# EAGLE design MicroMod-Ethernet-Function-Board (EAGLE 9.6.2)
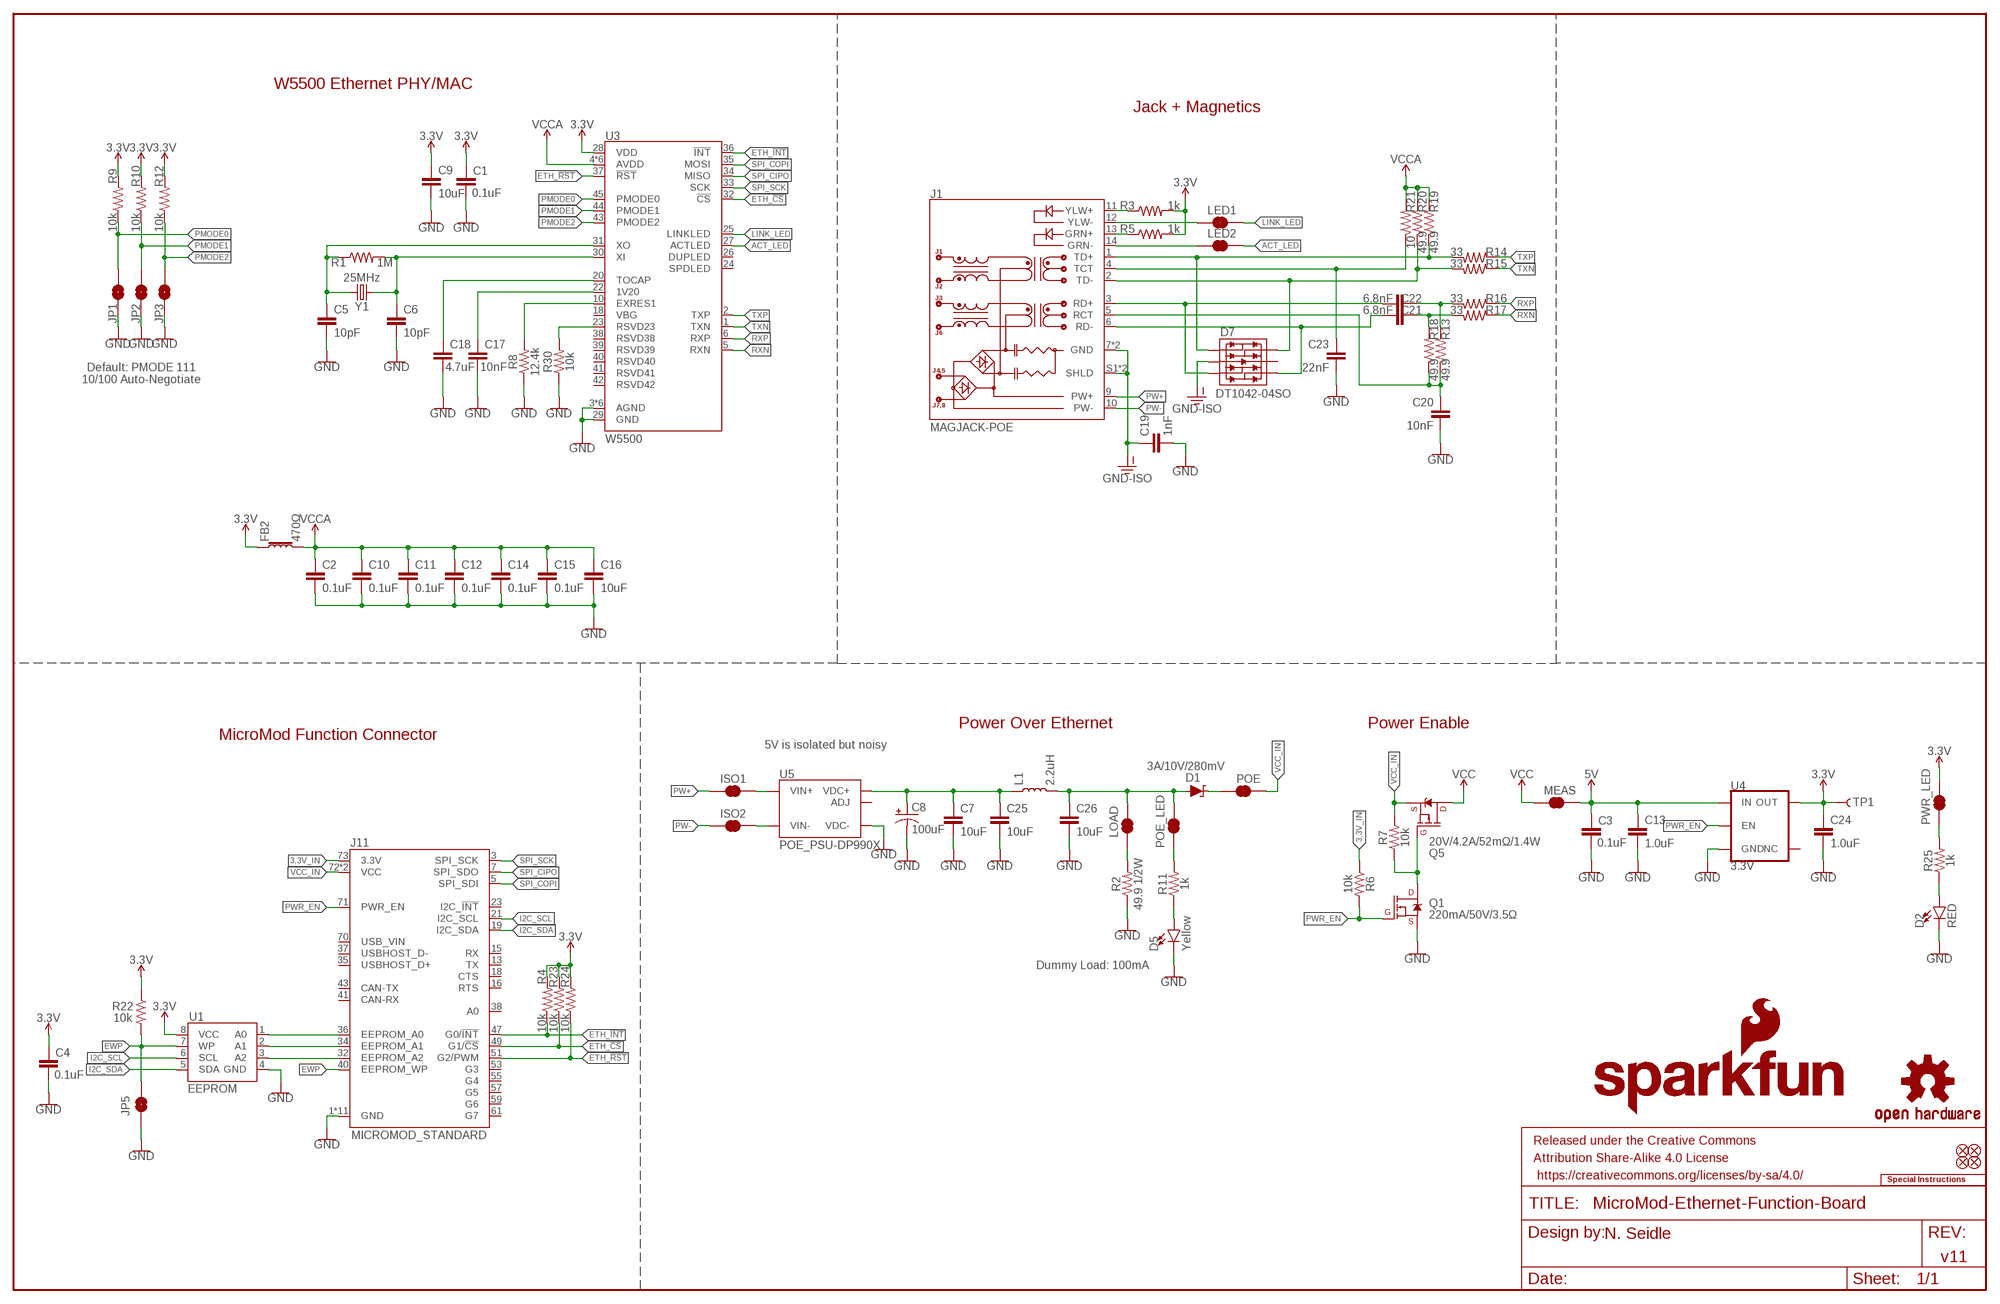
[diagram p0: schematic, sheet 1]

## Parts
C1  0.1uF  0.1UF-0603-25V-(+80/-20%)  [0603]
C2  0.1uF  0.1UF-0603-25V-5%  [0603]
C3  0.1uF  0.1UF-0603-25V-(+80/-20%)  [0603]
C4  0.1uF  0.1UF-0603-25V-(+80/-20%)  [0603]
C5  10pF  10PF-0603-50V-5%  [0603]
C6  10pF  10PF-0603-50V-5%  [0603]
C7  10uF  10UF-0805-25V-10%  [0805]
C8  100uF  100UF-POLAR-25V-20%(ELEC)  [PANASONIC_D]
C9  10uF  10UF-0603-6.3V-20%  [0603]
C10  0.1uF  0.1UF-0603-25V-5%  [0603]
C11  0.1uF  0.1UF-0603-25V-5%  [0603]
C12  0.1uF  0.1UF-0603-25V-5%  [0603]
C13  1.0uF  1.0UF-0603-16V-10%  [0603]
C14  0.1uF  0.1UF-0603-25V-5%  [0603]
C15  0.1uF  0.1UF-0603-25V-5%  [0603]
C16  10uF  10UF-0603-6.3V-20%  [0603]
C17  10nF  10NF-0603-50V-10%  [0603]
C18  4.7uF  4.7UF-0603-6.3V-(10%)  [0603]
C19  1nF  1.0NF/1000PF-1206-2KV-10%  [1206]
C20  10nF  10NF-0603-50V-10%  [0603]
C21  6.8nF  6.8NF/6800PF-0603-50V-5%  [0603]
C22  6.8nF  6.8NF/6800PF-0603-50V-5%  [0603]
C23  22nF  22NF/22,000PF-0603-50V-10%  [0603]
C24  1.0uF  1.0UF-0603-16V-10%-X7R  [0603]
C25  10uF  10UF-0805-25V-10%  [0805]
C26  10uF  10UF-0805-25V-10%  [0805]
D1  3A/10V/280mV  DIODE-SCHOTTKY-BAT60A  [SOD-323]
D2  RED  LED-RED0603  [LED-0603]
D5  Yellow  LED-YELLOW0603  [LED-0603]
D7  DT1042-04SO  TVS_DIODE_ARRAYSMD  [SOT-23-6]
FB2  470Ω  FERRITE_BEAD-0603-470Ω-100MHZ-1A-200MILIΩ  [0603]
FD1  FIDUCIALUFIDUCIAL  [FIDUCIAL-MICRO]
FD2  FIDUCIALUFIDUCIAL  [FIDUCIAL-MICRO]
FD3  FIDUCIALUFIDUCIAL  [FIDUCIAL-MICRO]
FD4  FIDUCIALUFIDUCIAL  [FIDUCIAL-MICRO]
FRAME1  FRAME-LEDGER  [CREATIVE_COMMONS]
ISO1  JUMPER-COMBO_2_NC_TRACE  [COMBO-JUMPER_2_NC_TRACE]
ISO2  JUMPER-COMBO_2_NC_TRACE  [COMBO-JUMPER_2_NC_TRACE]
J1  MAGJACK-POE  [MAGJACK-SYM_LED]
J11  MICROMOD_STANDARD  [M.2-CARD-E-22_FUNCTION_STANDARD]
JP1  JUMPER-SMT_2_NO_SILK  [SMT-JUMPER_2_NO_SILK]
JP2  JUMPER-SMT_2_NO_SILK  [SMT-JUMPER_2_NO_SILK]
JP3  JUMPER-SMT_2_NO_SILK  [SMT-JUMPER_2_NO_SILK]
JP5  JUMPER-SMT_2_NO_SILK  [SMT-JUMPER_2_NO_SILK]
L1  2.2uH  INDUCTOR-0805_WIDE-2.2UH  [0805-WIDE]
LED1  JUMPER-SMT_2_NC_TRACE_SILK  [SMT-JUMPER_2_NC_TRACE_SILK]
LED2  JUMPER-SMT_2_NC_TRACE_SILK  [SMT-JUMPER_2_NC_TRACE_SILK]
LOAD  JUMPER-SMT_2_NC_TRACE_SILK  [SMT-JUMPER_2_NC_TRACE_SILK]
LOGO1  SFE_LOGO_NAME_FLAME.1_INCH  [SFE_LOGO_NAME_FLAME_.1]
LOGO2  SPECIAL_INSTRUCTIONS-ORDERING  [ORDERING_INSTRUCTIONS]
LOGO3  OSHW-LOGOMINI  [OSHW-LOGO-MINI]
MEAS  JUMPER-COMBO_2_NC_TRACE  [COMBO-JUMPER_2_NC_TRACE]
POE  JUMPER-SMT_2_NC_TRACE_SILK  [SMT-JUMPER_2_NC_TRACE_SILK]
POE_LED  JUMPER-SMT_2_NC_TRACE_SILK  [SMT-JUMPER_2_NC_TRACE_SILK]
PWR_LED  JUMPER-SMT_2_NC_TRACE_SILK  [SMT-JUMPER_2_NC_TRACE_SILK]
Q1  220mA/50V/3.5Ω  MOSFET-NCH-BSS138  [SOT23-3]
Q5  20V/4.2A/52mΩ/1.4W  MOSFET_PCH-DMG2305UX-7  [SOT23-3]
R1  1M  1MOHM-0603-1/4W-5%  [0603]
R2  49.9 1/2W  49.9OHM-1206-1/2W-1%  [1206]
R3  1k  1KOHM-0603-1/10W-1%  [0603]
R4  10k  10KOHM-0603-1/10W-1%  [0603]
R5  1k  1KOHM-0603-1/10W-1%  [0603]
R6  10k  10KOHM-0603-1/10W-1%  [0603]
R7  10k  10KOHM-0603-1/10W-1%  [0603]
R8  12.4k  12.4KOHM-0603-1/10W-1%  [0603]
R9  10k  10KOHM-0603-1/10W-1%  [0603]
R10  10k  10KOHM-0603-1/10W-1%  [0603]
R11  1k  1KOHM-0603-1/10W-1%  [0603]
R12  10k  10KOHM-0603-1/10W-1%  [0603]
R13  49.9  49.9OHM-0603-1/10W-1%  [0603]
R14  33  33OHM-0603-1/10W-1%  [0603]
R15  33  33OHM-0603-1/10W-1%  [0603]
R16  33  33OHM-0603-1/10W-1%  [0603]
R17  33  33OHM-0603-1/10W-1%  [0603]
R18  49.9  49.9OHM-0603-1/10W-1%  [0603]
R19  49.9  49.9OHM-0603-1/10W-1%  [0603]
R20  49.9  49.9OHM-0603-1/10W-1%  [0603]
R21  10  10OHM-0603-1/10W-1%  [0603]
R22  10k  10KOHM-0603-1/10W-1%  [0603]
R23  10k  10KOHM-0603-1/10W-1%  [0603]
R24  10k  10KOHM-0603-1/10W-1%  [0603]
R25  1k  1KOHM-0603-1/10W-1%  [0603]
R30  10k  10KOHM-0603-1/10W-1%  [0603]
TP1  TEST-POINT3X4  [PAD.03X.04]
U1  EEPROM  EEPROM-I2C512K  [SO08]
U3  W5500  [LQFP-48]
U4  3.3V  V_REG_AP2112K-3.3V  [SOT23-5]
U5  POE_PSU-DP990X  [DP990X]
Y1  25MHz  CRYSTAL-25MHZ-SMD-2.0X1.6MM  [CRYSTAL-SMD-2.0X1.6MM]

## Nets
3.3V: C1.1 C4.1 C9.1 C24.1 FB2.1 PWR_LED.2 R3.2 R4.2 R5.2 R9.2 R10.2 R12.2 R22.1 R23.2 R24.2 TP1.1 U1.8(VCC) U3.28(VDD) U4.5(OUT)
3.3V_IN: J11.73(3.3V) R6.1
5V: C3.1 C13.1 MEAS.2 MEAS.4 U4.1(IN)
5V_FILTER: C26.1 D1.A L1.2 LOAD.2 POE_LED.2
5V_RAW: C7.1 C8.+ C25.1 L1.1 U5.1(VDC+) U5.2(VDC+)
A0: J11.36(EEPROM_A0) U1.1(A0)
A1: J11.34(EEPROM_A1) U1.2(A1)
A2: J11.32(EEPROM_A2) U1.3(A2)
ACT_LED: LED2.2 U3.27(ACTLED)
ETH_!CS!: J11.49(G1/!CS!) R23.1 U3.32(!CS!)
ETH_!INT!: J11.47(G0/!INT!) R4.1 U3.36(!INT!)
ETH_!RST!: J11.51(G2/PWM) R24.1 U3.37(!RST!)
EWP: J11.40(EEPROM_WP) JP5.2 R22.2 U1.7(WP)
GND: C1.2 C2.2 C3.2 C4.2 C5.2 C6.2 C7.2 C8.- C9.2 C10.2 C11.2 C12.2 C13.2 C14.2 C15.2 C16.2 C17.2 C18.2 C19.2 C20.2 C23.2 C24.2 C25.2 C26.2 D2.C D5.C J11.1(GND) J11.33(GND) J11.39(GND) J11.45(GND) J11.75(GND) J11.GND1(GND) J11.GND2(GND) J11.GND3(GND) J11.GND4(GND) J11.GND5(GND) J11.GND6(GND) JP1.1 JP2.1 JP3.1 JP5.1 Q1.2(S) R2.1 R8.1 R30.1 U1.4(GND) U3.3(AGND) U3.9(AGND) U3.14(AGND) U3.16(AGND) U3.19(AGND) U3.29(GND) U3.48(AGND) U4.2(GND) U5.3(VDC-)
GND-ISO: C19.1 D7.2(VSS) J1.7(GND) J1.8(GND) J1.S1(SHLD) J1.S2(SHLD)
I2C_SCL: J11.21(I2C_SCL) U1.6(SCL)
I2C_SDA: J11.19(I2C_SDA) U1.5(SDA)
LINK_LED: LED1.2 U3.25(LINKLED)
N$1: C5.1 R1.1 U3.31(XO) Y1.1
N$2: C6.1 R1.2 U3.30(XI) Y1.3
N$3: J1.14(GRN-) LED2.1
N$4: J1.12(YLW-) LED1.1
N$5: D5.A R11.1
N$6: POE_LED.1 R11.2
N$7: D1.C POE.1
N$8: J1.13(GRN+) R5.1
N$9: LOAD.1 R2.2
N$10: J1.11(YLW+) R3.1
N$11: Q1.3(D) Q5.1(G) R7.1
N$13: R8.2 U3.10(EXRES1)
N$15: C17.1 U3.22(1V20)
N$16: C18.1 U3.20(TOCAP)
N$17: R30.2 U3.23(RSVD23)
N$19: PWR_LED.1 R25.2
N$20: D2.A R25.1
PMODE0: JP1.2 R9.1 U3.45(PMODE0)
PMODE1: JP2.2 R10.1 U3.44(PMODE1)
PMODE2: JP3.2 R12.1 U3.43(PMODE2)
PW1+: ISO1.2 ISO1.4 U5.5(VIN+) U5.6(VIN+)
PW1-: ISO2.2 ISO2.4 U5.7(VIN-) U5.8(VIN-)
PW+: ISO1.1 ISO1.3 J1.9(PW+)
PW-: ISO2.1 ISO2.3 J1.10(PW-)
PWR_EN: J11.71(PWR_EN) Q1.1(G) R6.2 U4.3(EN)
RCT: C20.1 J1.5(RCT) R13.1 R18.1
RD+: C22.2 D7.3(IO2) J1.3(RD+)
RD-: C21.2 D7.4(IO3) J1.6(RD-)
RXN: R17.1 U3.5(RXN)
RXN1: C21.1 R17.2 R18.2
RXP: R16.1 U3.6(RXP)
RXP1: C22.1 R13.2 R16.2
SPI_CIPO: J11.7(SPI_SDO) U3.34(MISO)
SPI_COPI: J11.5(SPI_SDI) U3.35(MOSI)
SPI_SCK: J11.3(SPI_SCK) U3.33(SCK)
TCT: C23.1 J1.4(TCT) R21.1
TD+: D7.1(IO1) J1.1(TD+) R14.2 R19.1
TD-: D7.6(IO4) J1.2(TD-) R15.2 R20.1
TXN: R15.1 U3.1(TXN)
TXP: R14.1 U3.2(TXP)
VCC: MEAS.1 MEAS.3 Q5.3(D)
VCC_IN: J11.72(VCC) J11.74(VCC) POE.2 Q5.2(S) R7.2
VCCA: C2.1 C10.1 C11.1 C12.1 C14.1 C15.1 C16.1 FB2.2 R19.2 R20.2 R21.2 U3.4(AVDD) U3.8(AVDD) U3.11(AVDD) U3.15(AVDD) U3.17(AVDD) U3.21(AVDD)
Unconnected: D7.5(VCC) J11.13(TX) J11.15(RX) J11.16(RTS) J11.18(CTS) J11.23(I2C_!INT!) J11.35(USBHOST_D+) J11.37(USBHOST_D-) J11.38(A0) J11.41(CAN-RX) J11.43(CAN-TX) J11.53(G3) J11.55(G4) J11.57(G5) J11.59(G6) J11.61(G7) J11.70(USB_VIN) U3.18(VBG) U3.24(SPDLED) U3.26(DUPLED) U3.38(RSVD38) U3.39(RSVD39) U3.40(RSVD40) U3.41(RSVD41) U3.42(RSVD42) U4.4(NC) U5.4(ADJ)

## Notes on the sheet
- W5500 Ethernet PHY/MAC
- Jack + Magnetics
- Default: PMODE 111
  10/100 Auto-Negotiate
- Power Over Ethernet | Power Enable
- MicroMod Function Connector
- 5V is isolated but noisy
- Dummy Load: 100mA
- N. Seidle
- v11

## Library data of the parts
C1 C3 C4 = SparkFun-Capacitors:0.1UF: 0.1µF ceramic capacitors A capacitor is a passive two-terminal electrical component used to store electrical energy temporarily in an electric field.; PROD_ID: CAP-00810
C2 C10-C12 C14 C15 = SparkFun-Capacitors:0.1UF: 0.1µF ceramic capacitors A capacitor is a passive two-terminal electrical component used to store electrical energy temporarily in an electric field.; PROD_ID: CAP-08604
C5 C6 = SparkFun-Capacitors:10PF: 10pF ceramic capacitors A capacitor is a passive two-terminal electrical component used to store electrical energy temporarily in an electric field.; PROD_ID: CAP-11812
C7 C25 C26 = SparkFun-Capacitors:10UF: 10.0µF ceramic capacitors A capacitor is a passive two-terminal electrical component used to store electrical energy temporarily in an electric field.; PROD_ID: CAP-14259
C8 = SparkFun-Capacitors:100UF-POLAR: 100µF polarized capacitors A capacitor is a passive two-terminal electrical component used to store electrical energy temporarily in an electric field.; PROD_ID: CAP-12547
C9 C16 = SparkFun-Capacitors:10UF: 10.0µF ceramic capacitors A capacitor is a passive two-terminal electrical component used to store electrical energy temporarily in an electric field.; PROD_ID: CAP-11015
C13 = SparkFun-Capacitors:1.0UF: 1µF ceramic capacitors A capacitor is a passive two-terminal electrical component used to store electrical energy temporarily in an electric field.; PROD_ID: CAP-00868
C17 C20 = SparkFun-Capacitors:10NF: 0.01uF/10nF/10,000pF ceramic capacitors A capacitor is a passive two-terminal electrical component used to store electrical energy temporarily in an electric field. CAP-09321; PROD_ID: CAP-00867
C18 = SparkFun-Capacitors:4.7UF: 4.7µF ceramic capacitors A capacitor is a passive two-terminal electrical component used to store electrical energy temporarily in an electric field.; PROD_ID: CAP-08280
C19 = SparkFun-Capacitors:1.0NF/1000PF: 1nF/1,000pF ceramic capacitors A capacitor is a passive two-terminal electrical component used to store electrical energy temporarily in an electric field.; PROD_ID: CAP-16238
C21 C22 = SparkFun-Capacitors:6.8NF/6800PF: 5.6nF/5600pF ceramic capacitors A capacitor is a passive two-terminal electrical component used to store electrical energy temporarily in an electric field.; PROD_ID: CAP-16239
C23 = SparkFun-Capacitors:22NF/22,000PF: 0.022uF/22nF/22,000pF ceramic capacitors A capacitor is a passive two-terminal electrical component used to store electrical energy temporarily in an electric field.; PROD_ID: CAP-07885
C24 = SparkFun-Capacitors:1.0UF: 1µF ceramic capacitors A capacitor is a passive two-terminal electrical component used to store electrical energy temporarily in an electric field.; PROD_ID: CAP-13930
D1 = SparkFun-DiscreteSemi:DIODE-SCHOTTKY: Schottky diode A Schottky diode is a semiconductor diode which has a low forward voltage drop and a very fast switching action.; PROD_ID: DIO-14072
D2 = SparkFun-LED:LED-RED: Red SMD LED Used in manufacturing of most products at SparkFun Packages: 0603 - SMD 0603 package [Product Link] <http://docs.avagotech.com/docs/AV02-0551EN> 0603 SMART - SMD 0603 SMART package ( more efficient and expensive)[Product Link] <http://www.osram-os.com/Graphics/XPic2/00077099_0.pdf> 1206 - SMD1206 package [Product Link] <https://www.sparkfun.com/datasheets/DevTools/LilyPad/Q150OVS4.pdff> SparkFun Products: Pro Mini 328 -5V <https://www.sparkfun.com/products/821> RedBoard <https://www.sparkfun.com/products/12757> IOIO-OTG <https://www.sparkfun.com/products/13613>; PROD_ID: DIO-00819
D5 = SparkFun-LED:LED-YELLOW: Yellow SMD LED Used in manufacturing several products at SparkFun. Packages: 0603 - SMD 0603 package[Product Link] <http://www.kingbrightusa.com/product.asp?catalog_name=LED&product_id=APT1608SYCK> 0603 -SMART - SMART SMD 0603 package (more efficient/more expensive) [Product Link] <http://www.osram-os.com/osram_os/en/products/product-catalog/led-light-emitting-diodes/smartled-0603/ly-l29k/index.jsp> LilyPad - SMD1206 package[Product Datasheet] <https://www.sparkfun.com/datasheets/DevTools/LilyPad/Q150YUS4.pdf> SparkFun Products: Blynk Board <https://www.sparkfun.com/products/13794> IOIO-OTG <https://www.sparkfun.com/products/13613> XBee Explorer Serial <https://www.sparkfun.com/products/13225>; PROD_ID: DIO-09003
D7 = SparkFun-DiscreteSemi:TVS_DIODE_ARRAY; PROD_ID: IC-13538; VALUE: ESD Diode
FB2 = SparkFun-Coils:FERRITE_BEAD: Ferrite Bead (blocks, cores, rings, chokes, etc.) Inductor with layers of ferrite used to suppress high frequencies. Often used to isolate high frequency noise. SparkFun Products: IOIO-OTG - V2.2 <https://www.sparkfun.com/products/13613> SparkFun SAMD21 Mini Breakout <https://www.sparkfun.com/products/13664> SparkFun 6 Degrees of Freedom Breakout - LSM6DS3 <https://www.sparkfun.com/products/13339> SparkFun SAMD21 Dev Breakout <https://www.sparkfun.com/products/13672>; PROD_ID: NDUC-12579
FD1-FD4 = SparkFun-Aesthetics:FIDUCIAL: Fiducial Alignment Points Point-of-reference for pick-and-place machines and other optical instruments.
FRAME1 = SparkFun-Aesthetics:FRAME-LEDGER: Schematic Frame - Ledger Standard 11x14 US Ledger frame
ISO1 ISO2 MEAS = SparkFun-Jumpers:JUMPER-COMBO_2_NC_TRACE
J1 = SparkFun-Connectors:MAGJACK-POE: MAGJACK: RJ-45 with POE and LEDs This is a single port, RJ45 ethernet jacks with built in transformer (magnetics), PoE rectifier diodes, status LEDs, and shielding.; PROD_ID: CONN-16253
J11 = SparkFun-MicroMod-Function:MICROMOD: MicroMod Connector Description: A card edge connector and mating PCB connector to allow various MicroMod Processor Boards to be coupled with various carrier boards of different capabilities. Based on the M.2 standard.
JP1-JP3 JP5 = SparkFun-Jumpers:JUMPER-SMT_2_NO: Normally open jumper This jumper has two pads in close proximity to each other. Apply solder to close the connection. Round pads are easier to solder for beginners, but are a lot larger. SparkFun Product that uses the round pads: SparkFun EL Sequencer <https://www.sparkfun.com/products/12781>
L1 = SparkFun-Coils:INDUCTOR: Inductors Resist changes in electrical current. Basically a coil of wire. SparkFun Products: SparkFun Load Cell Amplifier - HX711 <https://www.sparkfun.com/products/13879> IOIO-OTG - V2.2 <https://www.sparkfun.com/products/13613>; PROD_ID: NDUC-14234
LED1 LED2 LOAD POE POE_LED PWR_LED = SparkFun-Jumpers:JUMPER-SMT_2_NC_TRACE: Normally closed trace jumper This jumper has a trace between two pads so it's normally closed (NC). Use a razor knife to open the connection. For best results follow the IPC guidelines for cutting traces: Cutout at least 0.063 mm (0.005 in). Remove all loose material to clean up the cut area. Seal the cut with an approved epoxy. Reapply solder to reclose the connection.
LOGO1 = SparkFun-Aesthetics:SFE_LOGO_NAME_FLAME: SparkFun Font Logo w/ Flame This is the SparkFun full logo. The logo on the schematic will always be the same size; the package variant is the height of the flame part of the logo. Default layer for the logo on the board is tSilk.
LOGO2 = SparkFun-Aesthetics:SPECIAL_INSTRUCTIONS: Special Ordering/Production Instructions Alert Symbol for special PCB ordering instructions or unique production process warnings. Ordering Instructions Production Instructions Types of information that should be added to box: Copper weight Soldermask color Silk color PCB thickness Number of layers PCB Standard: 1.6mm FR4 1 oz copper immersion silver plating red soldermask white silkscreen Types of information that should be added to box: Special wash requirements Depaneling instructions Humidification Glue curing Default text settings: 0.07 inch 9% ratio 50% line distance
LOGO3 = SparkFun-Aesthetics:OSHW-LOGO: Open-Source Hardware (OSHW) Logo This logo indicates the piece of hardware it is found on incorporates a OSHW license and/or adheres to the definition of open source hardware found here: http://freedomdefined.org/OSHW
Q1 = SparkFun-DiscreteSemi:MOSFET-NCH: N-channel MOSFETs Voltage controlled devices that allow control of high current outputs. SparkFun Products: SparkFun OpenScale <https://www.sparkfun.com/products/13261> SparkFun Digital Sandbox <https://www.sparkfun.com/products/12651> SparkFun Monster Moto Shield <https://www.sparkfun.com/products/10182> SparkFun MOSFET Power Controller <https://www.sparkfun.com/products/11214>; PROD_ID: TRANS-00830
Q5 = SparkFun-DiscreteSemi:MOSFET_PCH: P-channel MOSFETs Voltage controlled devices that allow control of high current outputs. SparkFun Products: SparkFun ESP32 Thing <https://www.sparkfun.com/products/13907> SparkFun ESP8266 Thing <https://www.sparkfun.com/products/13231> SparkFun Pi Servo HAT V2 <https://www.sparkfun.com/products/15316> DMG2305UX-7 (20V/4.2A/SOT23-3); PROD_ID: TRANS-14388
R1 = SparkFun-Resistors:1MOHM: 1MΩ resistor A resistor is a passive two-terminal electrical component that implements electrical resistance as a circuit element. Resistors act to reduce current flow, and, at the same time, act to lower voltage levels within circuits. - Wikipedia; PROD_ID: RES-07868
R2 = SparkFun-Resistors:49.9OHM: 49.9Ω resistor A resistor is a passive two-terminal electrical component that implements electrical resistance as a circuit element. Resistors act to reduce current flow, and, at the same time, act to lower voltage levels within circuits. - Wikipedia; PROD_ID: RES-16252
R3 R5 R11 R25 = SparkFun-Resistors:1KOHM: 1kΩ resistor A resistor is a passive two-terminal electrical component that implements electrical resistance as a circuit element. Resistors act to reduce current flow, and, at the same time, act to lower voltage levels within circuits. - Wikipedia; PROD_ID: RES-07856
R4 R6 R7 R9 R10 R12 R22-R24 R30 = SparkFun-Resistors:10KOHM: 10kΩ resistor A resistor is a passive two-terminal electrical component that implements electrical resistance as a circuit element. Resistors act to reduce current flow, and, at the same time, act to lower voltage levels within circuits. - Wikipedia; PROD_ID: RES-00824
R8 = SparkFun-Resistors:12.4KOHM: 12.4kΩ resistor A resistor is a passive two-terminal electrical component that implements electrical resistance as a circuit element. Resistors act to reduce current flow, and, at the same time, act to lower voltage levels within circuits. - Wikipedia; PROD_ID: RES-16236
R13 R18-R20 = SparkFun-Resistors:49.9OHM: 49.9Ω resistor A resistor is a passive two-terminal electrical component that implements electrical resistance as a circuit element. Resistors act to reduce current flow, and, at the same time, act to lower voltage levels within circuits. - Wikipedia; PROD_ID: RES-16237
R14-R17 = SparkFun-Resistors:33OHM: 33Ω resistor A resistor is a passive two-terminal electrical component that implements electrical resistance as a circuit element. Resistors act to reduce current flow, and, at the same time, act to lower voltage levels within circuits. - Wikipedia; PROD_ID: RES-08270
R21 = SparkFun-Resistors:10OHM: 10Ω resistor A resistor is a passive two-terminal electrical component that implements electrical resistance as a circuit element. Resistors act to reduce current flow, and, at the same time, act to lower voltage levels within circuits. - Wikipedia; PROD_ID: RES-12581
TP1 = SparkFun-Connectors:TEST-POINT: SparkFun Test Points Bare copper test points for troubleshooting or In-Circuit-Testing. These are used by our Production team for verifying production board runs using pogo-pins on test beds. SparkFun Products: SparkFun LSM9DS1 Breakout <https://www.sparkfun.com/products/13284> SparkFun PSOC <https://www.sparkfun.com/products/13714> SparkFun Load Cell Amplifier <https://www.sparkfun.com/products/13879>
U1 = SparkFun-IC-Memory:EEPROM-I2C: I2C EEPROMs, 24LC256 and others 24LC256 Series 256 kb I2C 2 Wire (32 k x 8 Bit) 2.5 V Serial EEPROM SMD - SOIC-8 Datasheet SparkFun Products SparkFun UDB5 - PIC UAV Development Board <https://www.sparkfun.com/products/11703> (GPS-11703); PROD_ID: IC-14645
U3 = SparkFun-IC-Comms:W5500; PROD_ID: IC-16240
U4 = SparkFun-IC-Power:V_REG_AP2112: AP2112 - 600mA CMOS LDO Regulator w/ Enable The AP2112 is CMOS process low dropout linear regulator with enable function, the regulator delivers a guaranteed 600mA (min.) continuous load current. Features Output Voltage Accuracy: ±1.5% Output Current: 600mA (Min.) Foldback Short Current Protection: 50mA Enable Function to Turn ON/OFF VOUT Low Dropout Voltage (3.3V): 250mV (Typ.) @IOUT=600mA Excellent Load Regulation: 0.2%/A (Typ.) Excellent Line Regulation: 0.02%/V (Typ.) Low Quiescent Current: 55μA (Typ.) Low Standby Current: 0.01μA (Typ.) Low Output Noise: 50μVRMS PSRR: 100Hz -65dB, 1kHz -65dB OTSD Protection Stable with 1.0μF Flexible Cap: Ceramic, Tantalum and Aluminum Electrolytic Operation Temperature Range: -40°C to 85°C ESD: MM 400V, HBM 4000V; PROD_ID: VREG-12457
U5 = SparkFun-IC-Power:POE_PSU: A special function Power Over Ethernet module with 5V or 12V output. Comes in an SMD package.; PROD_ID: IC-16251
Y1 = SparkFun-Clocks:CRYSTAL-25MHZ: 25MHz Crystal; PROD_ID: XTAL-16235

## Net classes
0 default: width 0 mm, drill 0 mm
1 vcc: width 0 mm

## Board
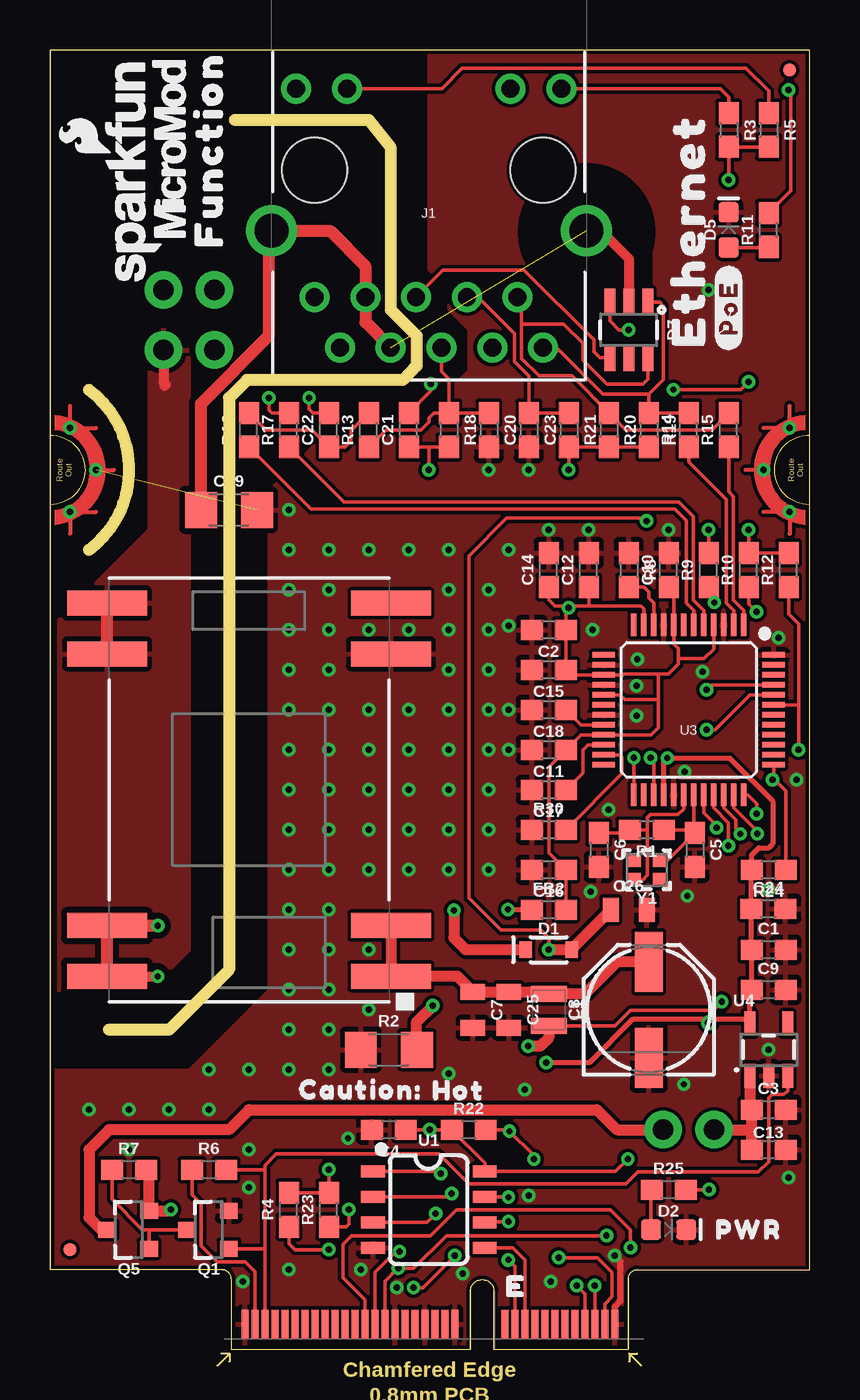
[diagram p1: board, top side]
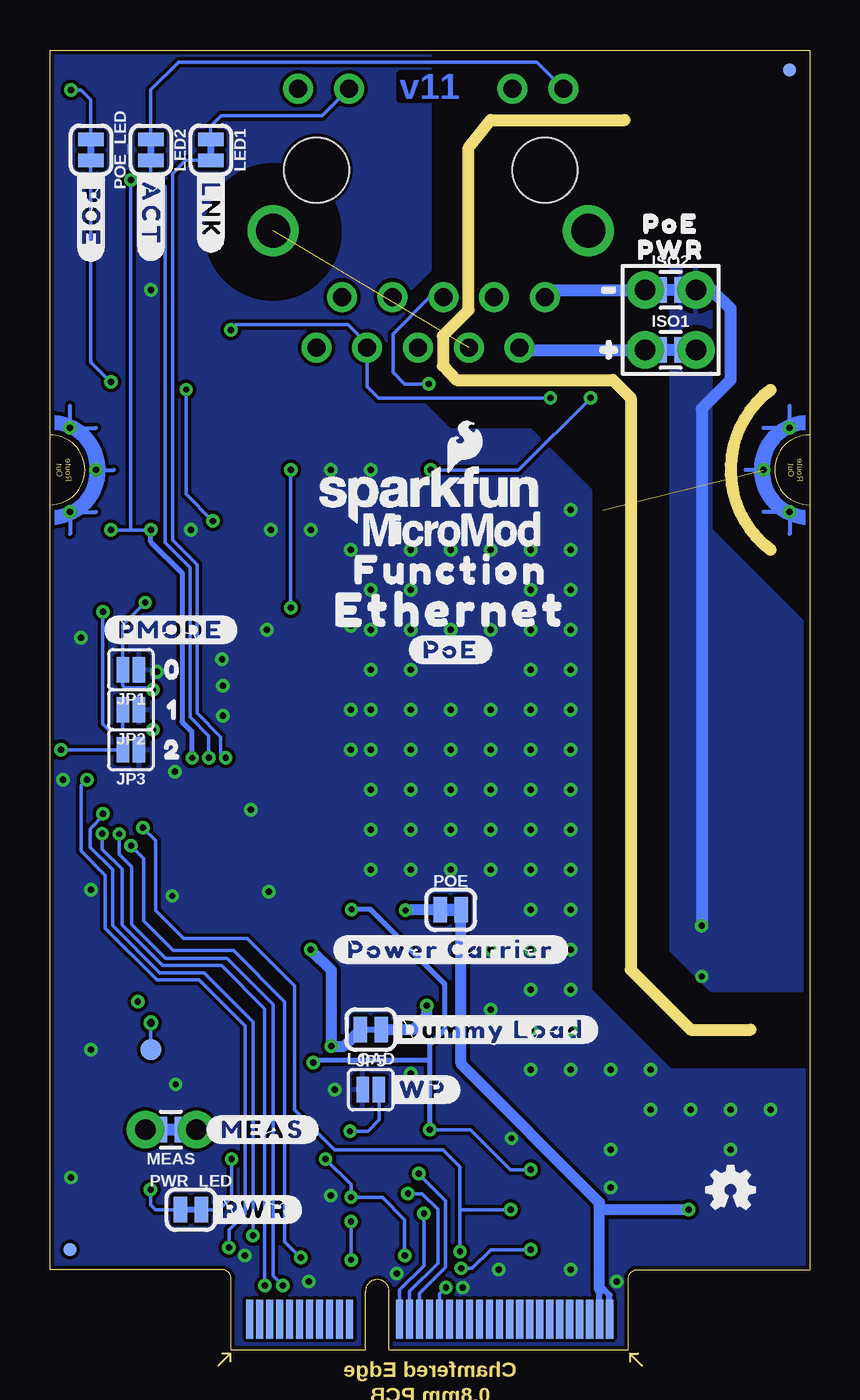
[diagram p2: board, bottom side, seen from below]

Size 38 x 65 mm. Coordinates in mm from the lower left corner, seen from the top.
Outline: 28.93,0 22.22,0 22.22,2.9 arc180 21.02,2.9 21.02,0 9.07,0 9.07,3.5 arc90 8.6,4 0,4 0,65 38,65 38,4 29.4,4 arc90 28.93,3.5 28.93,0
Copper layers (1*16): Top/Horz 0.035mm / dielectric 1.5mm / Bottom/Vert 0.035mm
Design rules "SparkFun-2-layer-TIGHT *": minimum track width 7mil, minimum drill 12mil, track to track 7mil, track to pad 7mil, pad to pad 7mil, via to via 7mil, smd to smd 7mil, copper to edge 7mil, drill to drill 7mil, minimum pad ring 7mil, minimum via ring 7mil, stop-mask expansion 4mil, vias tented up to drill 25mil, thermal gap 10mil
tRestrict: area 23.7,52.8 to 30,59; area 26.7,52.3 to 29.9,55.9
bRestrict: area 23.7,52.8 to 30,59
Milling: 12 lines

### Footprints (pad centres in the part's own frame; a part is rotated, then mirrored left to right if it is on the bottom)
0603 = smd 1.1 x 1: 1 -0.85,0; 2 0.85,0
0805 = smd 0.8 x 1.2: 1 -0.9,0; 2 0.9,0
PANASONIC_D = smd 3 x 1.4: + 2.4,0; - -2.4,0
1206 = smd 1.6 x 1.8: 1 -1.4,0; 2 1.4,0
SOD-323 = smd 0.63 x 0.83: A 1.15,0; C -1.15,0
LED-0603 = smd 1 x 1: A -0.877,0; C 0.877,0
SOT-23-6 = smd 0.55 x 1.35: 1 -0.95,-1.375; 2 0,-1.375; 3 0.95,-1.375; 4 0.95,1.375; 5 0,1.375; 6 -0.95,1.375
FIDUCIAL-MICRO = smd 0.635 x 0.635: 1 0,0
COMBO-JUMPER_2_NC_TRACE = smd 0.635 x 1.27: 1 -0.508,0; 2 0.508,0 | drill 1.016 pad 1.88: 3 -1.27,0; 4 1.27,0
MAGJACK-SYM_LED = drill 0.9 pad 1.5: 1 -5.715,8.89; 2 -4.445,6.35; 3 -3.175,8.89; 4 -1.905,6.35; 5 -0.635,8.89; 6 0.635,6.35; 7 1.905,8.89; 8 3.175,6.35; 9 4.445,8.89; 10 5.715,6.35; 11 -6.63,-4.06; 12 -4.09,-4.06; 13 4.09,-4.06; 14 6.63,-4.06 | drill 1.7 pad 2.4: S1 -7.875,3.05; S2 7.875,3.05 | hole 3.25: -5.715,0; 5.715,0
M.2-CARD-E-22_FUNCTION_STANDARD = smd 0.35 x 1.45: 1 9.25,1.275; 3 8.75,1.275; 5 8.25,1.275; 7 7.75,1.275; 9 7.25,1.275; 11 6.75,1.275; 13 6.25,1.275; 15 5.75,1.275; 17 5.25,1.275; 19 4.75,1.275; 21 4.25,1.275; 23 3.75,1.275; 33 1.25,1.275; 35 0.75,1.275; 37 0.25,1.275; 39 -0.25,1.275; 41 -0.75,1.275; 43 -1.25,1.275; 45 -1.75,1.275; 47 -2.25,1.275; 49 -2.75,1.275; 51 -3.25,1.275; 53 -3.75,1.275; 55 -4.25,1.275; 57 -4.75,1.275; 59 -5.25,1.275; 61 -5.75,1.275; 63 -6.25,1.275; 65 -6.75,1.275; 67 -7.25,1.275; 69 -7.75,1.275; 71 -8.25,1.275; 73 -8.75,1.275; 75 -9.25,1.275 | smd 0.35 x 1.95 bottom: 2 9,1.525; 4 8.5,1.525; 6 8,1.525; 8 7.5,1.525; 10 7,1.525; 12 6.5,1.525; 14 6,1.525; 16 5.5,1.525; 18 5,1.525; 20 4.5,1.525; 22 4,1.525; 32 1.5,1.525; 34 1,1.525; 36 0.5,1.525; 38 0,1.525; 40 -0.5,1.525; 42 -1,1.525; 44 -1.5,1.525; 46 -2,1.525; 48 -2.5,1.525; 50 -3,1.525; 52 -3.5,1.525; 54 -4,1.525; 56 -4.5,1.525; 58 -5,1.525; 60 -5.5,1.525; 62 -6,1.525; 64 -6.5,1.525; 66 -7,1.525; 68 -7.5,1.525; 70 -8,1.525; 72 -8.5,1.525; 74 -9,1.525 | drill 0.305 pad 0.61: GND1 -18,41.9; GND2 -16.7,44; GND3 -18,46.1; GND4 18,41.9; GND5 16.7,44; GND6 18,46.1
SMT-JUMPER_2_NO_SILK = smd 0.635 x 1.27: 1 -0.406,0; 2 0.406,0
0805-WIDE = smd 0.8 x 1.8: 1 -0.8,0; 2 0.8,0
SMT-JUMPER_2_NC_TRACE_SILK = smd 0.66 x 1.27: 1 -0.521,0; 2 0.521,0
SOT23-3 = smd 0.8 x 0.9: 1 -0.95,-1; 2 0.95,-1; 3 0,1.1
PAD.03X.04 = smd 1.016 x 1.016: 1 0,0
SO08 = smd 0.6 x 1.2: 1 -1.905,-2.8; 2 -0.635,-2.8; 3 0.635,-2.8; 4 1.905,-2.8; 5 1.905,2.8; 6 0.635,2.8; 7 -0.635,2.8; 8 -1.905,2.8
LQFP-48 = smd 0.254 x 1.143: 1 -2.75,-4.25; 2 -2.25,-4.25; 3 -1.75,-4.25; 4 -1.25,-4.25; 5 -0.75,-4.25; 6 -0.25,-4.25; 7 0.25,-4.25; 8 0.75,-4.25; 9 1.25,-4.25; 10 1.75,-4.25; 11 2.25,-4.25; 12 2.75,-4.25; 25 2.75,4.25; 26 2.25,4.25; 27 1.75,4.25; 28 1.25,4.25; 29 0.75,4.25; 30 0.25,4.25; 31 -0.25,4.25; 32 -0.75,4.25; 33 -1.25,4.25; 34 -1.75,4.25; 35 -2.25,4.25; 36 -2.75,4.25 | smd 1.143 x 0.254: 13 4.25,-2.75; 14 4.25,-2.25; 15 4.25,-1.75; 16 4.25,-1.25; 17 4.25,-0.75; 18 4.25,-0.25; 19 4.25,0.25; 20 4.25,0.75; 21 4.25,1.25; 22 4.25,1.75; 23 4.25,2.25; 24 4.25,2.75; 37 -4.25,2.75; 38 -4.25,2.25; 39 -4.25,1.75; 40 -4.25,1.25; 41 -4.25,0.75; 42 -4.25,0.25; 43 -4.25,-0.25; 44 -4.25,-0.75; 45 -4.25,-1.25; 46 -4.25,-1.75; 47 -4.25,-2.25; 48 -4.25,-2.75
SOT23-5 = smd 0.55 x 1.2: 1 -0.95,-1.3; 2 0,-1.3; 3 0.95,-1.3; 4 0.95,1.3; 5 -0.95,1.3
DP990X = smd 1.25 x 4: 1 -9.33,-7.1; 2 -6.79,-7.1; 3 6.79,-7.1; 4 9.33,-7.1; 5 9.33,7.1; 6 6.79,7.1; 7 -6.79,7.1; 8 -9.33,7.1
CRYSTAL-SMD-2.0X1.6MM = smd 0.75 x 0.7: 1 -0.675,-0.5; 2 0.675,-0.5; 3 0.675,0.5; 4 -0.675,0.5

### Placement (x,y rotation side)
C1  35.95,20 0 top
C2  24.95,36 180 top
C3  35.95,12 0 top
C4  16.95,11 180 top
C5  32.25,25 270 top
C6  27.45,25 270 top
C7  21.15,17 270 top
C8  29.95,17 90 top
C9  35.95,18 0 top
C10  30.95,39 90 top
C11  24.95,30 180 top
C12  26.95,39 90 top
C13  35.95,10 0 top
C14  24.95,39 90 top
C15  24.95,34 180 top
C16  24.95,24 180 top
C17  24.95,28 180 top
C18  24.95,32 180 top
C19  8.95,42 0 top
C20  21.95,46 270 top
C21  17.95,46 90 top
C22  13.95,46 90 top
C23  23.95,46 270 top
C24  35.94,22.05 0 top
C25  22.95,17 270 top
C26  28.95,22 0 top
D1  24.95,20 0 top
D2  30.95,6 0 top
D5  33.95,56 90 top
D7  28.95,51 180 top
FB2  24.95,22 0 top
FD1  1,5 90 top
FD2  37,64 90 top
FD3  37,5 270 bottom
FD4  1,64 270 bottom
FRAME1  35.51,-8.89 0 top  (outside the outline)
ISO1  6.95,50 0 bottom
ISO2  6.95,53 0 bottom
J1  18.95,59 180 top
J11  19,0 0 top
JP1  33.95,34 180 bottom
JP2  33.95,32 180 bottom
JP3  33.95,30 180 bottom
JP5  21.95,13 0 bottom
L1  24.95,17 270 top
LED1  29.95,60 270 bottom
LED2  32.95,60 270 bottom
LOAD  21.95,16 180 bottom
LOGO1  4.14,58.97 90 top
LOGO2  45.67,60.96 0 top  (outside the outline)
LOGO3  3.95,8 0 bottom
LOGO4  SFE_LOGO_NAME_FLAME.1_INCH  [SFE_LOGO_NAME_FLAME_.1]  18.97,42.76 0 bottom
MEAS  31.95,11 180 bottom
POE  17.95,22 0 bottom
POE_LED  35.95,60 270 bottom
PWR_LED  30.95,7 0 bottom
Q1  7.95,6 90 top
Q5  3.95,6 90 top
R1  29.85,26 180 top
R2  16.95,15 0 top
R3  33.95,61 270 top
R4  11.95,7 90 top
R5  35.95,61 270 top
R6  7.95,9 0 top
R7  3.95,9 0 top
R8  28.95,39 270 top
R9  32.95,39 90 top
R10  34.95,39 90 top
R11  35.95,56 90 top
R12  36.95,39 90 top
R13  15.95,46 90 top
R14  31.95,46 90 top
R15  33.95,46 90 top
R16  9.95,46 90 top
R17  11.95,46 90 top
R18  19.95,46 270 top
R19  29.95,46 270 top
R20  27.95,46 270 top
R21  25.95,46 270 top
R22  20.95,11 0 top
R23  13.95,7 90 top
R24  35.95,24 180 top
R25  30.95,8 0 top
R30  24.95,26 0 top
TP1  32.95,15 0 bottom
U1  18.95,7 270 top
U3  31.95,32 180 top
U4  35.95,15 0 top
U5  9.95,28 90 top
U$1  [ETHERNET0]  17.95,37 0 bottom
U$2  [#POE#0]  17.95,35 0 bottom
U$3  [#POWER_CARRIER#0]  17.95,20 0 bottom
U$5  [#DUMMY_LOAD#0]  15.85,16 0 bottom
U$6  [#WP#0]  19.35,13 0 bottom
U$7  [PWR0]  34.95,6 0 top
U$8  [#ACT#0]  32.95,56.8 270 bottom
U$9  [POE0]  6.95,56.3 0 bottom
U$12  [#LNK#1]  29.95,57 270 bottom
U$13  [#PMODE#0]  31.95,36 0 bottom
U$14  [01]  31.85,34 0 bottom
U$15  [12]  31.85,32 0 bottom
U$16  [23]  31.85,30 0 bottom
U$17  [ETHERNET0]  31.95,56 90 top
U$18  [#POE#0]  33.95,52.1 90 top
U$19  [#0]  9.95,50 0 bottom
U$20  [CAUTION#0]  15.55,13 0 top
U$21  [HOT#1]  20.45,13.1 0 top
U$22  [#PWR#0]  27.75,7 0 bottom
U$23  [#_POE#0]  35.95,56.8 270 bottom
U$24  [PWR1]  6.95,55 0 bottom
U$25  [#1]  9.95,53 0 bottom
U$26  [FUNCTION0]  7.95,60 90 top
U$27  [FUNCTION0]  17.95,39 0 bottom
U$28  [#MEAS#3]  30.15,11 0 bottom
U$37  [MICROMOD_LOGO_.35]  17.95,41 0 bottom
U$63  [MICROMOD_LOGO_.35]  6,60 90 top
Y1  29.85,24 180 top

### Tracks (layer width: path | path; a pad name or v marks a point on that pad's centre or on a via)
3.3V  (via drill 0.3, 0.38)
  Top/Horz 0.178: R5.2 R3.2 v33.95,58.5 | v34.95,41 R10.2 R12.2 | R9.2 v32.95,41 | C4.1 v19,11 R22.1 21.75,9.35 U1.8 28.29,8.9 v28.91,9.53 | R4.2 R23.2 v13.95,9 | v32.95,16.34 32.95,16.5
  Top/Horz 0.254: U3.28 30.7,29.4 v30.89,29.59 30.92,29.57 34.02,29.57 36.15,27.43 36.15,25.3 35.95,25.1 35.45,25.1 35.1,24.75 R24.2 35.05,24.05 35.05,24.1 35.09,24.06 C24.1 C1.1 C9.1 35,17.9 U4.5 34.8,16.5 32.95,16.5 29.13,16.5 26.98,14.35 v24.83,14.35 | FB2.1 23.11,22 v22.91,22
  Bottom/Vert 0.178: v32.95,41 33.95,41 | 33.95,41 v34.95,41 | v33.95,58.5 33.95,41 | v13.95,9 14.95,9 16.95,11 v19,11 | v28.91,9.53 28.91,7.62 29.54,6.99 30.41,6.99 PWR_LED.2 | TP1.1 v32.95,16.34
  Bottom/Vert 0.254: v30.89,29.59 30.89,30.89 31.39,31.39 31.39,38.84 32.95,40.4 v32.95,41 | 19,14.5 19,15.25 18.25,16 18.25,18.3 21.95,22 v22.91,22 | 19,14.5 v19,11 | v24.83,14.35 24.67,14.5 19,14.5 | v22.91,22
3.3V_IN
  Top/Horz 0.178: J11.73 10.25,3.9 9.77,4.38 8.37,4.38 7.57,5.18 7.57,7.28 7.1,7.75 R6.1
5V
  Top/Horz 0.559: C13.1 35.1,11 | 35.1,11 C3.1 35,12.1 U4.1 | MEAS.4 35.1,11
  Bottom/Vert 0.178: MEAS.4 MEAS.2
5V_FILTER  (via drill 0.3)
  Top/Horz 0.178: v33.61,17.4 33.18,16.97 29.02,16.97 28.25,16.2 L1.2 | v24.95,20 24.95,20.6 24.55,21 22.55,21 20.95,22.6 20.95,39.7 22.85,41.6 29.7,41.6 v29.85,41.45 | v31.19,48.01 34.56,48.01 v34.95,48.4
  Top/Horz 0.559: C26.1 26.1,20.05 D1.A v24.95,20 | L1.2 24.95,15.6 24.52,15.17 v23.92,15.17
  Bottom/Vert 0.178: v29.85,41.45 31.19,42.79 v31.19,48.01 | v34.95,48.4 35.95,49.4 POE_LED.2
  Bottom/Vert 0.559: v24.95,20 23.92,18.97 v23.92,15.17 23.3,15.17 LOAD.2
5V_RAW
  Top/Horz 0.559: U5.2 U5.1 20.38,18.67 C7.1 C25.1 24.85,17.9 L1.1 26.75,17.8 28.35,19.4 C8.+
A0  (via drill 0.3)
  Top/Horz 0.178: U1.1 19.45,8.9 v19.55,8.8
  Bottom/Vert 0.178: J11.36 19.5,2.83 18.2,4.12 18.2,7.45 v19.55,8.8
A1  (via drill 0.3)
  Top/Horz 0.178: U1.2 19.93,7.63 v20.1,7.8
  Bottom/Vert 0.178: J11.34 20,2.92 18.6,4.33 18.6,7 19.4,7.8 v20.1,7.8
A2  (via drill 0.3)
  Top/Horz 0.178: U1.3 18.86,6.37 v19.3,6.8
  Bottom/Vert 0.178: J11.32 20.5,3 19.3,4.2 | 19.3,4.2 v19.3,6.8 | 19.3,4.2
ACT_LED  (via drill 0.3)
  Top/Horz 0.178: U3.27 30.2,29.6 v30.05,29.6
  Bottom/Vert 0.178: v30.05,29.6 30.05,30.7 31,31.65 31,39.1 32.25,40.35 32.25,58.17 32.95,58.87 LED2.2
ETH_!CS!  (via drill 0.3)
  Top/Horz 0.178: J11.49 16.25,3.86 17.29,4.9 v17.49,4.9 | U3.32 32.7,26.83 33.35,26.18 v33.35,26.1 | R23.1 14.8,6.15 14.95,6.3 v14.95,7
  Bottom/Vert 0.178: v17.49,4.9 17.49,7 | 17.49,7 17.49,9.14 18.35,10 23.75,10 25.75,12 25.75,18.18 28.14,20.57 31.32,20.57 32.72,21.97 32.72,25.46 v33.35,26.1 | v14.95,7 17.49,7
ETH_!INT!  (via drill 0.3)
  Top/Horz 0.178: J11.47 16.75,3.42 17.39,4.06 v17.42,4.06 18.19,4.06 19.83,5.7 v27.85,5.7 | U3.36 34.9,27.75 35.35,27.3 v35.35,26.8 | R4.1 11.95,5.3 12.25,5 v13.95,5
  Bottom/Vert 0.178: v27.85,5.7 27.85,16.4 30.3,18.85 32.5,18.85 34.87,21.22 34.87,24 35.98,25.11 35.98,26.05 35.35,26.68 v35.35,26.8 | v13.95,5 15.94,5 16.89,4.06 v17.42,4.06
ETH_!RST!  (via drill 0.3)
  Top/Horz 0.178: v29.05,5.1 29.05,6 28.05,7 20.34,7 19.04,5.7 15.08,5.7 14.65,5.27 14.65,3.6 15.75,2.5 J11.51 | U3.37 36.2,28.55 | 36.2,28.55 v36.15,28.5 | R24.1 36.8,27.95 36.2,28.55
  Bottom/Vert 0.178: v36.15,28.5 36.45,28.2 36.45,24.94 35.23,23.72 35.23,21.07 32.65,18.49 30.54,18.49 28.25,16.2 28.25,6.8 29.05,6 v29.05,5.1
EWP  (via drill 0.3)
  Top/Horz 0.178: U1.7 22.92,7.63 v22.94,7.62 | v24.21,9.53 24.21,9.7 v22.99,10.92 22.91,11 R22.2 | v20.25,4.7 18.65,3.1 v18.19,3.1
  Bottom/Vert 0.178: v24.21,9.53 22.94,8.26 v22.94,7.62 21.37,7.62 20.25,6.5 v20.25,4.7 | v22.99,10.92 22.1,10.92 21.54,11.48 JP5.2 | v18.19,3.1 18.5,2.79 J11.40
GND  (via drill 0.3)  (1 unrouted)
  Top/Horz 0.305: J11.1 28.25,2.14 28.54,2.43 28.54,4.41 v28.25,4.7
  Bottom/Vert 0.178: J11.GND4 35.7,43.2 J11.GND5 | J11.GND3 2.3,44.8 J11.GND2 2.3,43.2 J11.GND1
  other vias: 3.95,10 17.35,3.1 20.65,3.8 36.95,8.6 35.95,15 35.95,23 27.05,22.9 31.75,28.9 29.35,31.7 29.35,33.2 29.4,34.53 27.15,36 36.45,35.6 32.65,33.9 30.95,41 26.95,41 24.95,41 22.95,36.2 22.95,32 22.95,30 21.95,28 21.95,26 11.95,42 21.95,44 14.92,10.56 23.95,7.7 15.55,4 9.65,3.4 9.95,10 15.95,17 13.95,22 23.75,13 23.95,44 27.95,27 31.71,13.26 11.95,4 13.95,24 13.95,26 13.95,28 13.95,30 13.95,32 13.95,34 13.95,36 13.95,38 13.95,40 13.95,20 13.95,18 13.95,16 13.95,14 11.95,14 11.95,16 11.95,18 11.95,20 11.95,22 11.95,24 11.95,26 11.95,28 11.95,30 11.95,32 11.95,34 11.95,36 11.95,38 11.95,40 15.95,24 15.95,26 15.95,28 15.95,30 15.95,32 15.95,36 15.95,40 15.95,20 17.95,24 17.95,26 17.95,28 17.95,30 17.95,32 17.95,36 17.95,40 19.95,24 19.95,26 19.95,28 19.95,30 19.95,32 19.95,34 19.95,36 19.95,38 19.95,40 19.95,13.8 31.89,22.68 21.95,30 21.95,32 21.95,34 21.95,36 21.95,38 22.95,40 21.95,24 9.95,14 7.95,12 7.95,14 5.95,12 3.95,12 1.95,12 9.95,8.1 32.95,53 37.35,28.5 25.05,3.4
  pour Top/Horz (isolate 0.152): -0.05,0 -0.05,14 6.95,14 10.95,18 10.95,43 13.95,46 17.95,46 20.95,49 20.95,51 19.95,52 19.95,53 18.95,54 18.95,65 37.95,65 37.95,0
  pour Bottom/Vert (isolate 0.152): -0.05,0 -0.05,14 6.95,14 10.95,18 10.95,43 13.95,46 17.95,46 20.95,49 20.95,51 19.95,52 19.95,53 18.95,54 18.95,65 37.95,65 37.95,0
GND-ISO  (1 unrouted)
  Top/Horz 0.508: J1.S1 27.57,55.95 28.95,54.57 D7.2
  Top/Horz 0.6: J1.7 15.77,51.38 J1.8 15.77,54.17 14,55.95 J1.S2 11.02,56 10.95,56 10.95,50.7 7.55,47.3 C19.1
I2C_SCL  (via drill 0.3)
  Top/Horz 0.178: J11.21 23.25,4.16 v22.93,4.48 | U1.6 21.79,6.4 v22.94,6.4
  Bottom/Vert 0.178: v22.93,4.48 22.93,6.39 v22.94,6.4
I2C_SDA
  Top/Horz 0.178: J11.19 23.75,4.5 23.15,5.1 U1.5
LINK_LED  (via drill 0.3)
  Top/Horz 0.178: U3.25 29.2,29.59 v29.21,29.6
  Bottom/Vert 0.178: v29.21,29.6 29.45,29.84 29.45,30.65 30.64,31.84 30.64,39.25 31.87,40.48 31.87,58.82 31.21,59.48 LED1.2
N$1
  Top/Horz 0.178: U3.31 32.2,26 | 32.2,26 32.2,25.9 C5.1 30.9,24.5 Y1.1 | R1.1 32.2,26
N$2
  Top/Horz 0.178: U3.30 31.7,27.05 31.42,26.77 30.04,26.77 29.88,26.61 29.88,26 | C6.1 28.85,25.85 R1.2 29.88,26 | 29.88,26 29.88,23.73 29.65,23.5 Y1.3
N$3
  Bottom/Vert 0.178: LED2.1 32.95,63.01 31.57,64.39 13.65,64.39 J1.14
N$4
  Bottom/Vert 0.178: LED1.1 29.95,61.2 29.43,61.72 24.38,61.72 J1.12
N$5
  Top/Horz 0.178: R11.1 35.92,55.12 D5.A
N$6  (via drill 0.3)
  Top/Horz 0.178: v36.95,63 37.05,62.9 37.05,57.95 R11.2
  Bottom/Vert 0.178: POE_LED.1 35.95,62.52 36.43,63 v36.95,63
N$7  (via drill 0.3)
  Top/Horz 0.559: v20.21,21.97 20.21,20.59 20.8,20 D1.C
  Bottom/Vert 0.559: POE.1 20.18,22 v20.21,21.97
N$8
  Top/Horz 0.178: J1.13 19.6,63.06 20.62,64.08 34.82,64.08 35.95,62.95 R5.1
N$9  (via drill 0.3)
  Top/Horz 0.559: R2.2 18.35,16.4 v19.15,17.2
  Bottom/Vert 0.559: v19.15,17.2 19.15,16.7 19.85,16 LOAD.1
N$10
  Top/Horz 0.178: J1.11 33.54,63.06 33.95,62.65 R3.1
N$11
  Top/Horz 0.178: Q1.3 4.9,6 | 4.9,6 4.62,6 3.1,7.52 R7.1 | Q5.1 4.95,5.95 4.9,6
N$13
  Top/Horz 0.178: U3.10 30.2,37.35 29.95,37.6 29.95,37.9 29.7,38.15 R8.2
N$15
  Top/Horz 0.178: U3.22 26.9,30.25 26.65,30 26.65,28.85 C17.1
N$16
  Top/Horz 0.178: U3.20 26.55,31.25 C18.1
N$17
  Top/Horz 0.178: R30.2 28.61,28.82 28.61,29.64 28.5,29.75 U3.23
N$19  (via drill 0.3)
  Top/Horz 0.178: R25.2 v32.97,8
  Bottom/Vert 0.178: v32.97,8 32.97,7.24 32.72,6.99 31.49,6.99 PWR_LED.1
N$20
  Top/Horz 0.178: D2.A 30.07,7.97 R25.1
PMODE0  (via drill 0.3)
  Top/Horz 0.178: U3.45 33.1,33.25 v32.85,33 | R9.1 33.23,37.87 v33.23,37.36
  Bottom/Vert 0.178: v32.85,33 32.95,33.1 34.25,33.1 34.36,33.2 JP1.2 34.36,36.24 v33.23,37.36
PMODE1  (via drill 0.3)
  Top/Horz 0.178: R10.1 34.95,37.3 v35.35,36.9 | U3.44 35,32.75 33.25,31 v32.85,31
  Bottom/Vert 0.178: v32.85,31 34.35,31 | 34.35,31 35.05,31 35.35,31.3 v35.35,36.9 | JP2.2 34.36,31.01 34.35,31
PMODE2  (via drill 0.3)
  Top/Horz 0.178: R12.1 36.95,36.8 37.45,36.3 37.45,32.2 | v37.45,30 37.45,32.2 | U3.43 37.4,32.25 37.45,32.2
  Bottom/Vert 0.178: v37.45,30 JP3.2
PW1+
  Top/Horz 0.508: ISO1.4 5.68,48.37 5.79,48.26 5.73,48.2
  Top/Horz 0.6: U5.6 U5.5
  Bottom/Vert 0.6: ISO1.2 ISO1.4
  pour Top/Horz (isolate 0.305): -0.05,18 4.95,18 6.95,20 6.95,50 5.95,51 4.95,51 4.95,41 -0.05,36
PW1-  (via drill 0.3)
  Top/Horz 0.508: U5.8 v5.38,18.67
  Top/Horz 0.6: v5.4,21.2 5.39,21.21 U5.7 U5.8
  Bottom/Vert 0.6: v5.4,21.2 5.4,47.05 3.96,48.49 3.96,52.09 4.88,53 ISO2.4 ISO2.2
  pour Bottom/Vert (isolate 0.305): 6.95,54 6.95,20 4.95,18 -0.05,18 -0.05,36 4.95,41 4.95,54
PW+
  Bottom/Vert 0.6: J1.9 14.39,50 ISO1.3 ISO1.1
PW-
  Bottom/Vert 0.6: J1.10 13.23,52.69 12.92,53 ISO2.3 ISO2.1
PWR_EN
  Top/Horz 0.178: U4.3 36.9,12.95 36.72,12.77 36.14,12.77 35.95,12.58 35.95,9.4 35.44,8.89 29.41,8.89 28.82,8.3 20.95,8.3 19.47,9.78 11.32,9.78 10.75,9.21 10.75,9 | Q1.1 9.95,5.05 10.27,5.05 10.7,5.05 10.75,5 | J11.71 10.75,5 | 10.75,5 10.75,9 | R6.2 10.75,9
RCT
  Top/Horz 0.178: R13.1 16.8,46 18.55,46 18.95,46.4 18.95,46.6 19.2,46.85 R18.1 | C20.1 R18.1 | R18.1 19.95,48.55 19.59,48.91 J1.5
RD+  (via drill 0.3)
  Top/Horz 0.178: C22.2 13.15,46.85 12.96,47.04 v12.96,47.6 | D7.3 28,51.45 28.45,51 v28.95,51
  Bottom/Vert 0.178: v12.96,47.6 21.55,47.6 22.12,48.17 J1.3 22.12,50.29 23.09,51.25 28.7,51.25 v28.95,51
RD-  (via drill 0.3)
  Top/Horz 0.178: C21.2 19.05,47.95 v19.05,48.3 | D7.4 27.5,49.62 27.2,49.92 27.2,50.52 23.72,54 19.66,54 J1.6
  Bottom/Vert 0.178: v19.05,48.3 20.25,48.3 20.85,48.9 20.85,50.8 19,52.65 J1.6
RXN
  Top/Horz 0.178: U3.5 32.7,36.97 32.18,37.49 32.18,41.67 31.45,42.4 14.7,42.4 R17.1
RXN1  (via drill 0.3)
  Top/Horz 0.178: C21.1 18.95,45.15 | 18.95,45.15 R18.2 | R17.2 11.1,46.85 10.95,47 v10.95,47.6 | v18.95,44 18.95,45.15
  Bottom/Vert 0.178: v10.95,47.6 14.55,44 v18.95,44
RXP
  Top/Horz 0.178: U3.6 32.2,36.97 31.83,37.34 31.83,41.47 31.25,42.04 13.06,42.04 R16.1
RXP1
  Top/Horz 0.178: R13.2 15.05,45.95 15.05,45.45 14.75,45.15 C22.1 13.1,46 10.8,46 R16.2
SPI_CIPO  (via drill 0.3)
  Top/Horz 0.178: J11.7 26.75,2.8 v26.35,3.2 | U3.34 33.7,27.1 34.3,26.5 34.3,26.03 v34.54,25.79
  Bottom/Vert 0.178: v26.35,3.2 26.85,3.7 26.85,17.27 29.14,19.56 32.21,19.56 33.91,21.26 33.91,24.14 34.54,24.77 v34.54,25.79
SPI_COPI  (via drill 0.3)
  Top/Horz 0.178: J11.5 v27.25,3.2 | U3.35 34.2,27.1 35.38,25.92 v35.38,25.8
  Bottom/Vert 0.178: v27.25,3.2 27.25,17.04 29.42,19.2 32.36,19.2 34.39,21.24 34.39,24.03 35.38,25.02 v35.38,25.8
SPI_SCK  (via drill 0.3)
  Top/Horz 0.178: J11.3 27.75,2.26 28.12,2.63 28.12,3.87 27.39,4.6 v25.45,4.6 | U3.33 33.2,27.09 33.95,26.35 v33.95,25.2
  Bottom/Vert 0.178: v25.45,4.6 26.25,5.4 26.25,17.4 28.81,19.96 31.85,19.96 33.31,21.43 33.31,24.57 v33.95,25.2
TCT
  Top/Horz 0.178: R21.1 C23.1 23.95,48.7 23.24,49.41 23.24,50.81 21.4,52.65 J1.4
TD+
  Top/Horz 0.178: R19.1 30.15,46.85 | 30.15,46.85 R14.2 | 30.15,46.85 29.97,47.03 29.97,47.8 | J1.1 25.34,50.11 27.65,47.8 29.96,47.8 29.97,47.8 | D7.1 30.51,52.38 30.68,52.2 30.68,48.51 29.97,47.8
TD-
  Top/Horz 0.178: R15.2 33.1,46 28.8,46 R20.1 26.1,48.7 24.45,48.7 23.59,49.55 23.59,51.3 | J1.2 23.59,52.45 23.59,51.3 | 23.59,51.3 25.7,51.3 26.65,50.35 26.65,49.5 27.85,48.3 29.65,48.3 29.9,48.55 D7.6
TXN
  Top/Horz 0.178: U3.1 34.7,36.97 34.18,37.49 34.18,42.67 33.95,42.9 R15.1
TXP
  Top/Horz 0.178: U3.2 34.2,36.97 33.83,37.34 33.83,42.52 31.95,44.4 R14.1
VCC
  Top/Horz 0.559: Q5.3 2.55,6 1.95,6.6 1.95,10 2.95,11 8.95,11 9.95,12 27.35,12 28.35,11 MEAS.3
  Bottom/Vert 0.178: MEAS.3 MEAS.1
VCC_IN  (via drill 0.3)
  Top/Horz 0.559: R7.2 4.95,8.85 Q5.2 6,6.95 v6.05,7
  Bottom/Vert 0.305: J11.74 10,2.73 10.4,3.12 10.44,3.12 10.5,3.06 10.5,3 J11.72
  Bottom/Vert 0.559: POE.2 17.43,14.28 10.5,7.35 10.5,7 | 10.5,3 10.5,7 | v6.05,7 10.5,7
VCCA  (via drill 0.3)
  Top/Horz 0.178: C10.1 31.2,37.9 U3.8 31.2,35.3 31.45,35.05 31.45,34.54 | U3.11 29.7,37.05 29.55,37.2 26.95,37.2 | U3.4 33.2,35.05 32.71,34.55 31.46,34.55 31.45,34.54 | R19.2 R20.2 R21.2 v25.95,44 | FB2.2 C16.1 24.95,24.85 24.95,29.15 C11.1 26.55,30.75 U3.21 30.06,30.75 30.43,31.11 30.43,32.51 | U3.17 28.52,32.75 28.76,32.51 30.43,32.51 | 31.45,34.54 31.45,34.29 30.94,33.78 30.43,33.78 | 30.43,33.78 30.43,32.51 | 30.43,33.78 29.81,33.78 29.8,33.8 28.7,33.8 28.66,33.75 U3.15 26.05,33.75 C15.1 C2.1 25.8,36.95 v25.95,37.1 25.95,37.2 | C14.1 24.95,37.5 25.25,37.2 25.95,37.2 | 26.95,37.2 25.95,37.2 | C12.1 26.95,37.2
  Bottom/Vert 0.178: v25.95,37.1 v25.95,44
(copper drawn outside any net)
  shapes: Bottom/Vert area x1

### Text on the board
Bottom/Vert: v11
Measures: Dimensions are in mm
tDocu: Board Thickness is 0.8mm | 2-Layer | Beveled Edge | ENIG Finish | N. Seidle